# EAGLE design OperantFEDv4 (EAGLE 7.7.0)
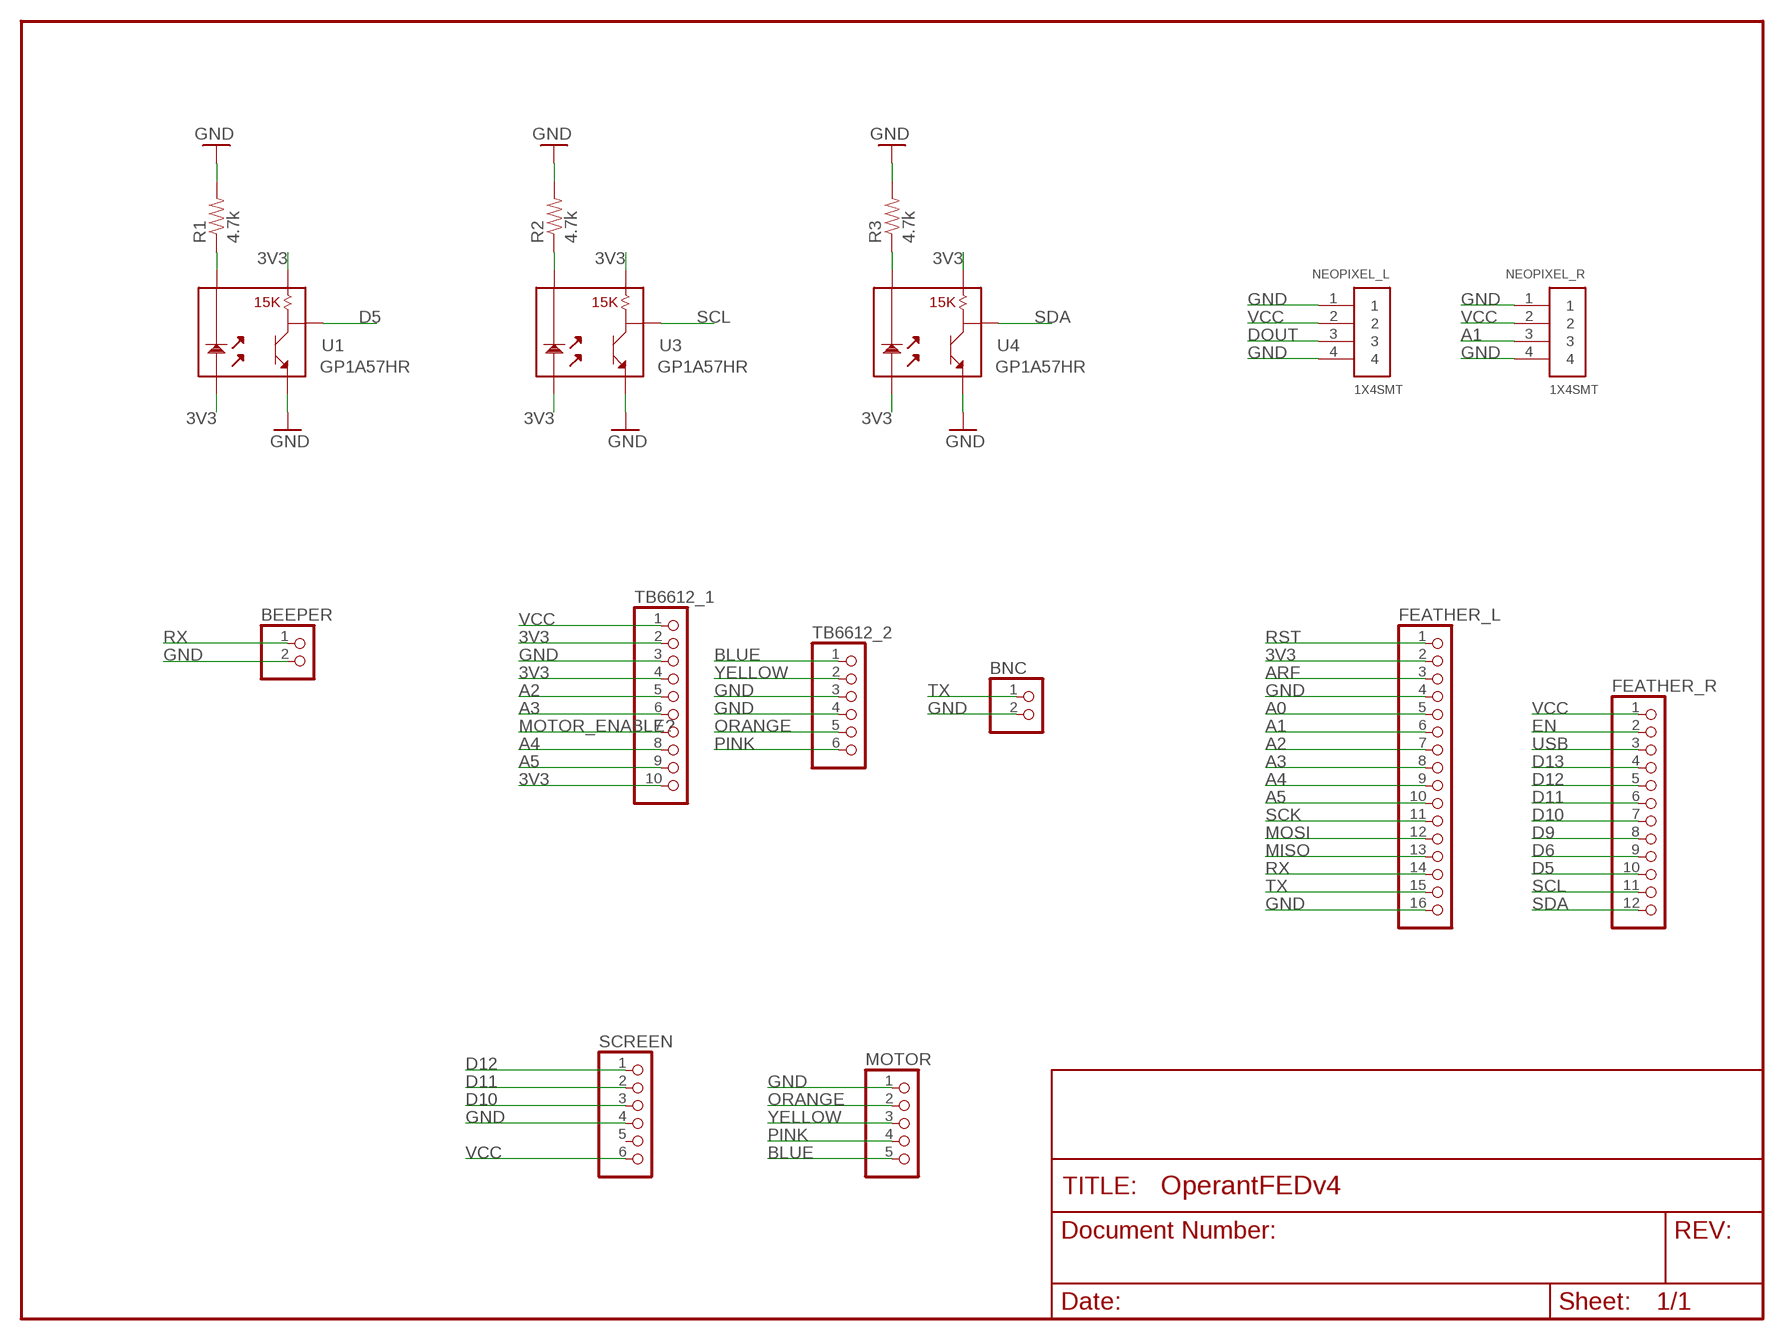
[diagram p0: schematic, sheet 1]

## Parts
BEEPER  PINHD-1X2  [1X02]
BNC  PINHD-1X2  [1X02]
FEATHER_L  PINHD-1X16  [1X16]
FEATHER_R  PINHD-1X12  [1X12]
MOTOR  PINHD-1X5  [1X05]
NEOPIXEL_L  1X4SMT  [1X4-SMT]
NEOPIXEL_R  1X4SMT  [1X4-SMT]
R1  4.7k  RESISTORPTH1  [AXIAL-0.3]
R2  4.7k  RESISTORPTH1  [AXIAL-0.3]
R3  4.7k  RESISTORPTH1  [AXIAL-0.3]
SCREEN  PINHD-1X6  [1X06]
TB6612_1  PINHD-1X10  [1X10]
TB6612_2  PINHD-1X6  [1X06]
U1  GP1A57HR  [GP1A57HR]
U3  GP1A57HR  [GP1A57HR]
U4  GP1A57HR  [GP1A57HR]

## Nets
3V3: FEATHER_L.2 TB6612_1.2 TB6612_1.4 TB6612_1.10 U1.1 U1.3 U3.1 U3.3 U4.1 U4.3
A0: FEATHER_L.5
A1: FEATHER_L.6 NEOPIXEL_R.3
A2: FEATHER_L.7 TB6612_1.5
A3: FEATHER_L.8 TB6612_1.6
A4: FEATHER_L.9 TB6612_1.8
A5: FEATHER_L.10 TB6612_1.9
ARF: FEATHER_L.3
BLUE: MOTOR.5 TB6612_2.1
D5: FEATHER_R.10 U1.4
D6: FEATHER_R.9
D9: FEATHER_R.8
D10: FEATHER_R.7 SCREEN.3
D11: FEATHER_R.6 SCREEN.2
D12: FEATHER_R.5 SCREEN.1
D13: FEATHER_R.4
DOUT: NEOPIXEL_L.3
EN: FEATHER_R.2
GND: BEEPER.2 BNC.2 FEATHER_L.4 FEATHER_L.16 MOTOR.1 NEOPIXEL_L.1 NEOPIXEL_L.4 NEOPIXEL_R.1 NEOPIXEL_R.4 R1.P$2 R2.P$2 R3.P$2 SCREEN.4 TB6612_1.3 TB6612_2.3 TB6612_2.4 U1.5 U3.5 U4.5
MISO: FEATHER_L.13
MOSI: FEATHER_L.12
MOTOR_ENABLE?: TB6612_1.7
N$1: R2.P$1 U3.2
N$2: R1.P$1 U1.2
N$3: R3.P$1 U4.2
ORANGE: MOTOR.2 TB6612_2.5
PINK: MOTOR.4 TB6612_2.6
RST: FEATHER_L.1
RX: BEEPER.1 FEATHER_L.14
SCK: FEATHER_L.11
SCL: FEATHER_R.11 U3.4
SDA: FEATHER_R.12 U4.4
TX: BNC.1 FEATHER_L.15
USB: FEATHER_R.3
VCC: FEATHER_R.1 NEOPIXEL_L.2 NEOPIXEL_R.2 SCREEN.6 TB6612_1.1
YELLOW: MOTOR.3 TB6612_2.2
Unconnected: SCREEN.5

## Library data of the parts
BEEPER BNC = pinhead:PINHD-1X2: PIN HEADER
FEATHER_L = pinhead:PINHD-1X16: PIN HEADER
FEATHER_R = pinhead:PINHD-1X12: PIN HEADER
MOTOR = pinhead:PINHD-1X5: PIN HEADER
NEOPIXEL_L NEOPIXEL_R = adafruit:1X4: 4-pin connector
R1-R3 = SparkFun:RESISTOR: Resistor Basic schematic elements and footprints for 0603, 1206, and PTH 1/10th watt (small) resistors.
SCREEN TB6612_2 = pinhead:PINHD-1X6: PIN HEADER
TB6612_1 = pinhead:PINHD-1X10: PIN HEADER
U1 U3 U4 = SparkFun:GP1A57HR

## Board
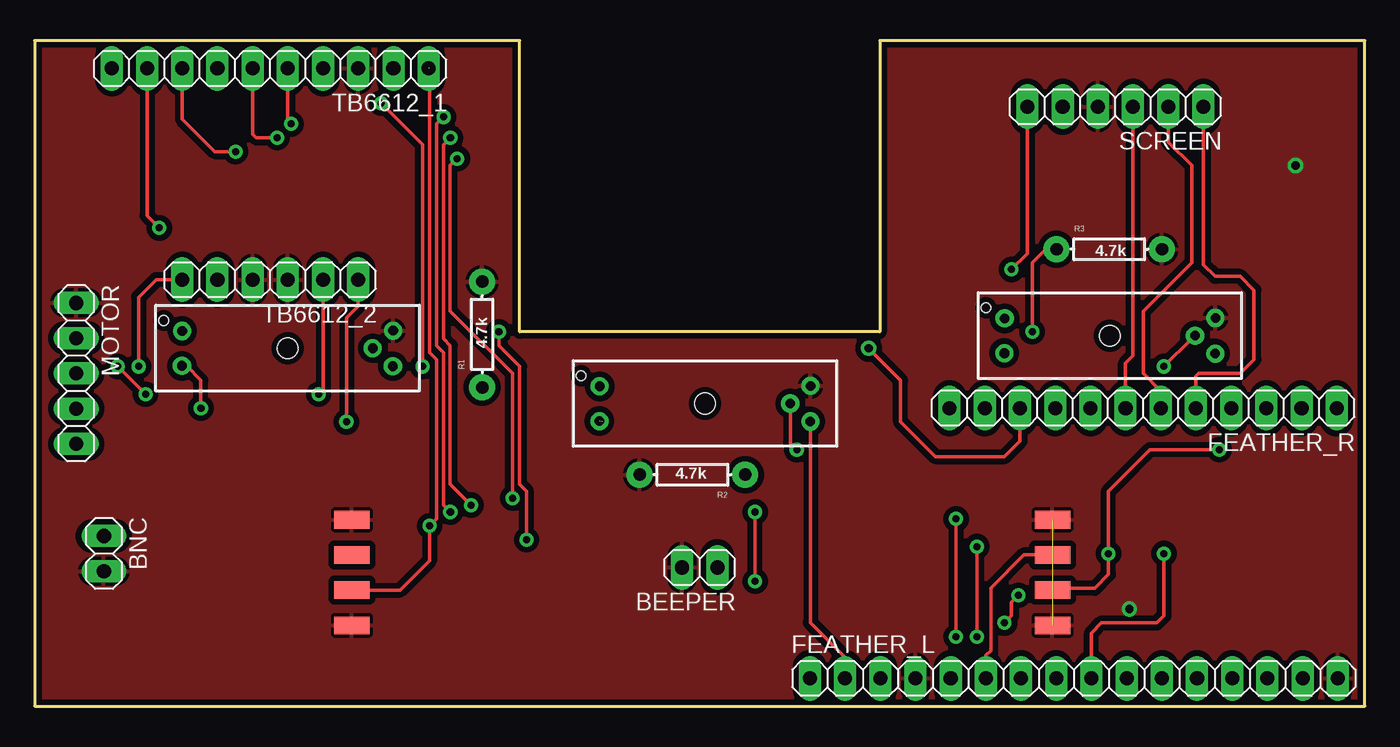
[diagram p1: board, top side]
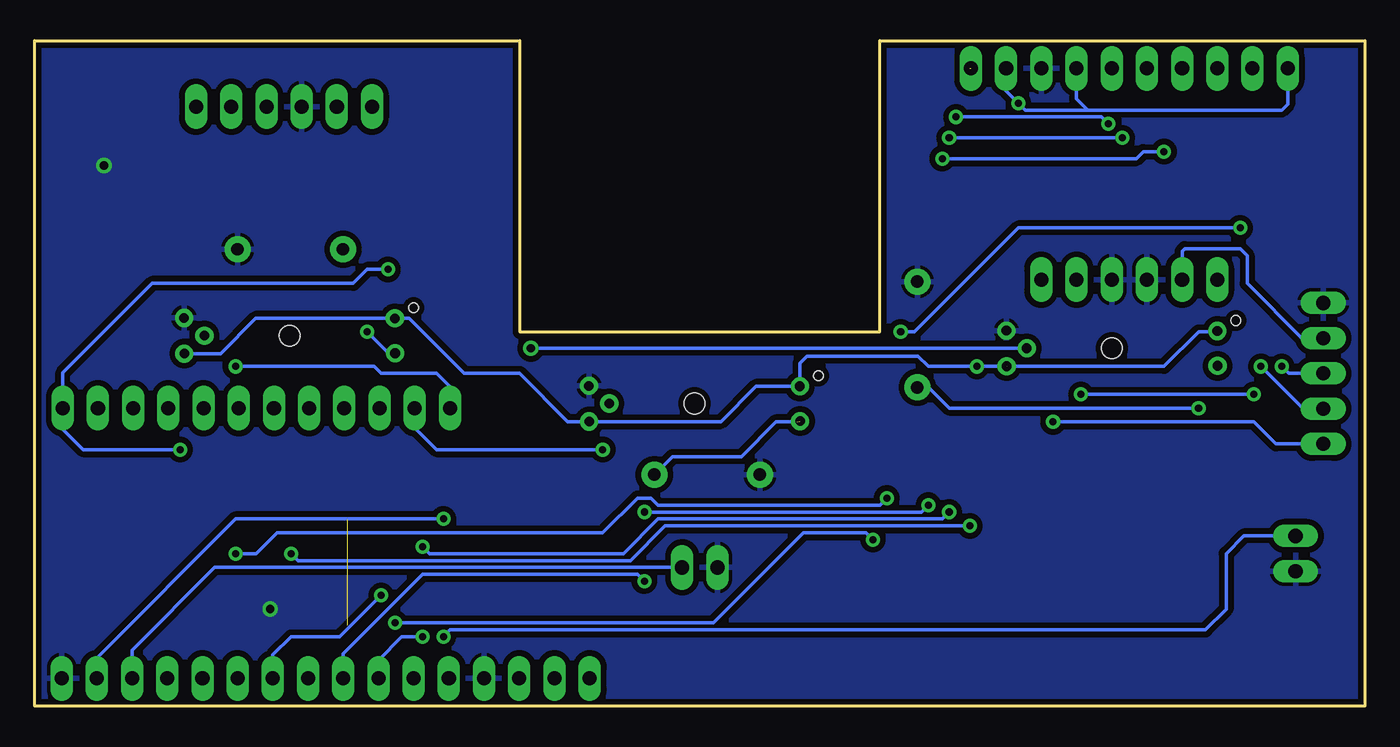
[diagram p2: board, bottom side, seen from below]

Size 96 x 48 mm. Coordinates in mm from the lower left corner, seen from the top.
Outline: 0,0 96,0 96,48 61,48 61,27 35,27 35,48 0,48 0,0
Copper layers (1*16): Top 0.0356mm / dielectric 1.5011mm / Bottom 0.0356mm
Design rules "default": minimum track width 8mil, minimum drill 20mil, track to track 8mil, track to pad 8mil, pad to pad 8mil, via to via 8mil, smd to smd 8mil, copper to edge 10mil, drill to drill 8mil, minimum pad ring 12mil, minimum via ring 10mil, stop-mask expansion 4mil, vias tented up to drill 20mil, thermal gap 10mil

### Footprints (pad centres in the part's own frame; a part is rotated, then mirrored left to right if it is on the bottom)
1X02 = drill 1.016 long: 1 -1.27,0; 2 1.27,0
1X16 = drill 1.016 long: 1 -19.05,0; 2 -16.51,0; 3 -13.97,0; 4 -11.43,0; 5 -8.89,0; 6 -6.35,0; 7 -3.81,0; 8 -1.27,0; 9 1.27,0; 10 3.81,0; 11 6.35,0; 12 8.89,0; 13 11.43,0; 14 13.97,0; 15 16.51,0; 16 19.05,0
1X12 = drill 1.016 long: 1 -13.97,0; 2 -11.43,0; 3 -8.89,0; 4 -6.35,0; 5 -3.81,0; 6 -1.27,0; 7 1.27,0; 8 3.81,0; 9 6.35,0; 10 8.89,0; 11 11.43,0; 12 13.97,0
1X05 = drill 1.016 long: 1 -5.08,0; 2 -2.54,0; 3 0,0; 4 2.54,0; 5 5.08,0
1X4-SMT = smd 1.27 x 2.54: 1 -3.81,0; 2 -1.27,0; 3 1.27,0; 4 3.81,0
AXIAL-0.3 = drill 0.9 pad 1.88: P$1 -3.81,0; P$2 3.81,0
1X06 = drill 1.016 long: 1 -6.35,0; 2 -3.81,0; 3 -1.27,0; 4 1.27,0; 5 3.81,0; 6 6.35,0
1X10 = drill 1.016 long: 1 -11.43,0; 2 -8.89,0; 3 -6.35,0; 4 -3.81,0; 5 -1.27,0; 6 1.27,0; 7 3.81,0; 8 6.35,0; 9 8.89,0; 10 11.43,0
GP1A57HR = drill 0.7: 1 -7.6,1.24; 2 -7.62,-1.27; 3 7.6,-1.3; 4 6.15,0; 5 7.62,1.27 | hole 1.5: 0,0 | hole 0.7: -8.95,2

### Placement (x,y rotation side)
BEEPER  48,10 180 top
BNC  5,11 270 top
FEATHER_L  75,2 0 top
FEATHER_R  80,21.5 180 top
MOTOR  3,24 270 top
NEOPIXEL_L  22.89,9.63 90 top
NEOPIXEL_R  73.46,9.63 90 top
R1  32.29,26.81 90 top
R2  47.47,16.69 180 top
R3  77.55,32.96 0 top
SCREEN  78,43.24 180 top
TB6612_1  17,46 180 top
TB6612_2  17,30.76 180 top
U1  18.25,25.82 0 top
U3  48.38,21.83 0 top
U4  77.6,26.73 0 top

### Tracks (layer width: path | path; a pad name or v marks a point on that pad's centre or on a via)
3V3  (via drill 0.51)  (1 unrouted)
  Top 0.203: FEATHER_L.2
  Top 0.254: FEATHER_L.2 58.5,3.5 55.98,6.02 U3.3 | v25,43.5 28,40.5 v28,24.5
  Bottom 0.254: 20,43 6,43 5.57,43.43 TB6612_1.10 | 20,43 24.5,43 v25,43.5 25.89,44.39 TB6612_1.2 | U1.1 11,27 12,27 14.5,24.5 25.83,24.5 | TB6612_1.4 20.81,43.81 20,43 | U4.3 82.57,25.43 80.03,27.97 U4.1 68.97,27.97 65,24 61,24 57.53,20.53 U3.3 46.47,20.53 43.93,23.07 U3.1 40.75,23.1 40.75,24.75 40.25,25.25 32.25,25.25 31.5,24.5 v28,24.5 27.98,24.52 U1.3 25.87,24.5
A1
  Top 0.254: FEATHER_L.6 68.65,3.65 69,4 69,8.5 71.41,10.9 NEOPIXEL_R.3
A2  (via drill 0.51)
  Top 0.254: v29.5,42.5 29,42 29,26 29.5,25.5 29.5,14.5 v30,14 | v68,5 v68,11.5 | TB6612_1.5 18.27,42.23 v18.5,42
  Bottom 0.254: v18.5,42 19,42.5 v29.5,42.5 | v30,14 30.5,13.5 51,13.5 53.5,11 67.5,11 v68,11.5 | v68,5 69.5,5 71.19,3.31 FEATHER_L.7
A3  (via drill 0.51)
  Top 0.254: v30,41 29.5,40.5 29.5,26.5 30,26 30,16 v31.5,14.5 | v52,9 v52,14 | TB6612_1.6 15.73,41.27 16,41 v17.5,41
  Bottom 0.254: v30,41 v17.5,41 | v31.5,14.5 32,14 v52,14 | v52,9 52.5,9.5 68,9.5 73.73,3.77 FEATHER_L.8
A4  (via drill 0.51)
  Top 0.254: v30.5,39.5 30,39 30,28.5 34.5,24 v34.5,15 | TB6612_1.8 10.65,42.35 13,40 v14.5,40 | FEATHER_L.9 76.27,5.27 77,6 81,6 81.5,6.5 v81.5,11
  Bottom 0.254: v34.5,15 35,14.5 51,14.5 51.5,15 52.5,15 55,12.5 78.5,12.5 80,11 v81.5,11 | v30.5,39.5 16.5,39.5 16,40 v14.5,40
A5  (via drill 0.51)
  Top 0.254: v33.5,27 33.5,26 35,24.5 35,16 35.5,15.5 v35.5,12 | v70,6 70.5,6.5 70.5,7.5 v71,8 | TB6612_1.9 8.11,35.39 v9,34.5
  Bottom 0.254: v33.5,27 32.5,27 25,34.5 v9,34.5 | v35.5,12 36,12.5 40.5,12.5 47,6 v70,6 | v71,8 74,5 77.5,5 78.81,3.69 FEATHER_L.10
BLUE  (via drill 0.51)
  Top 0.254: v22.5,20.5 22.5,28 23.35,28.85 TB6612_2.1
  Bottom 0.254: v22.5,20.5 8,20.5 6.42,18.92 MOTOR.5
D5  (via drill 0.6)
  Top 0.254: FEATHER_R.10 71.11,19.11 70,18 65,18 62.5,20.5 62.5,23.5 v60.18,25.82
  Bottom 0.254: U1.4 v60.18,25.82
D10
  Top 0.254: SCREEN.3 79.27,25.27 78.73,24.73 FEATHER_R.7
D11
  Top 0.254: SCREEN.2 81.81,40.69 83.5,39 83.5,32 80,28.5 80,24 81.27,22.73 FEATHER_R.6
D12
  Top 0.254: SCREEN.1 84.35,31.85 85.2,31 87,31 88,30 88,25 87,24 84,24 83.81,23.81 FEATHER_R.5
GND  (via drill 0.6)  (1 unrouted)
  other vias: 91,39 79,7
  pour Top (isolate 0.406): -5,-2.93 99.74,-2.93 99.74,52.1 -5,52.1
  pour Bottom (isolate 0.406): -6.97,53.97 -6.97,-5.05 101.44,-4.95 101.44,54.07
N$1  (1 unrouted)
  Bottom 0.254: 41,20.5 42.5,20.5 45,18 49.97,18 R2.P$1
N$2  (via drill 0.51)
  Top 0.254: v12,21.5 12,23.5 11,24.5 U1.2
  Bottom 0.254: v12,21.5 30,21.5 31.5,23 R1.P$1
N$3  (via drill 0.51)
  Top 0.254: v72,27 72,32 73,33 73.5,33 R3.P$1
  Bottom 0.254: v72,27 70.5,25.5 70,25.5 U4.2
ORANGE
  Bottom 0.254: MOTOR.2 3,26.5 4.5,26.5 8.5,30.5 8.5,32.5 9,33 13,33 13.19,32.81 TB6612_2.5
PINK  (via drill 0.51)
  Top 0.254: v7.5,24.5 7.5,29.5 8.76,30.76 TB6612_2.6
  Bottom 0.254: MOTOR.4 4.46,21.46 v7.5,24.5
RX
  Bottom 0.254: BEEPER.1 83,10 88.97,4.03 FEATHER_L.14
SCL  (via drill 0.51)
  Top 0.254: U3.4 54.53,18.97 v55,18.5
  Bottom 0.254: v55,18.5 67,18.5 68.57,20.07 FEATHER_R.11
SDA  (via drill 0.51)
  Top 0.254: v81.5,24.5 83.5,26.5 U4.4
  Bottom 0.254: FEATHER_R.12 66.03,23.03 67,24 71,24 71.5,24.5 v81.5,24.5
TX  (via drill 0.51)
  Top 0.254: v66.5,13.5 v66.5,5
  Bottom 0.254: v66.5,5 66,5.5 11.5,5.5 10,7 10,11 8.73,12.27 BNC.1 | FEATHER_L.15 91.5,3.5 81.5,13.5 v66.5,13.5
VCC  (via drill 0.51)  (1 unrouted)
  Top 0.254: NEOPIXEL_R.2 73.5,8.5 76.5,8.5 77.5,9.5 v77.5,11 77.5,15.5 80.5,18.5 v85.5,18.5 | 28.5,46 28.5,25.5 29,25 29,13.5 v28.5,13 28.5,10.5 26.36,8.37 NEOPIXEL_L.2 | SCREEN.6 71.65,32.65 v70.5,31.5
  Bottom 0.254: v85.5,18.5 92.5,18.5 93.97,19.97 FEATHER_R.1 93.97,24.03 87.5,30.5 73,30.5 72,31.5 v70.5,31.5 | v28.5,13 50.5,13 53,10.5 77,10.5 v77.5,11
YELLOW  (via drill 0.51)
  Top 0.254: v8,22.5 v6,24.5 | TB6612_2.2 20.81,22.81 v20.5,22.5
  Bottom 0.254: MOTOR.3 5.5,24 v6,24.5 | v20.5,22.5 v8,22.5